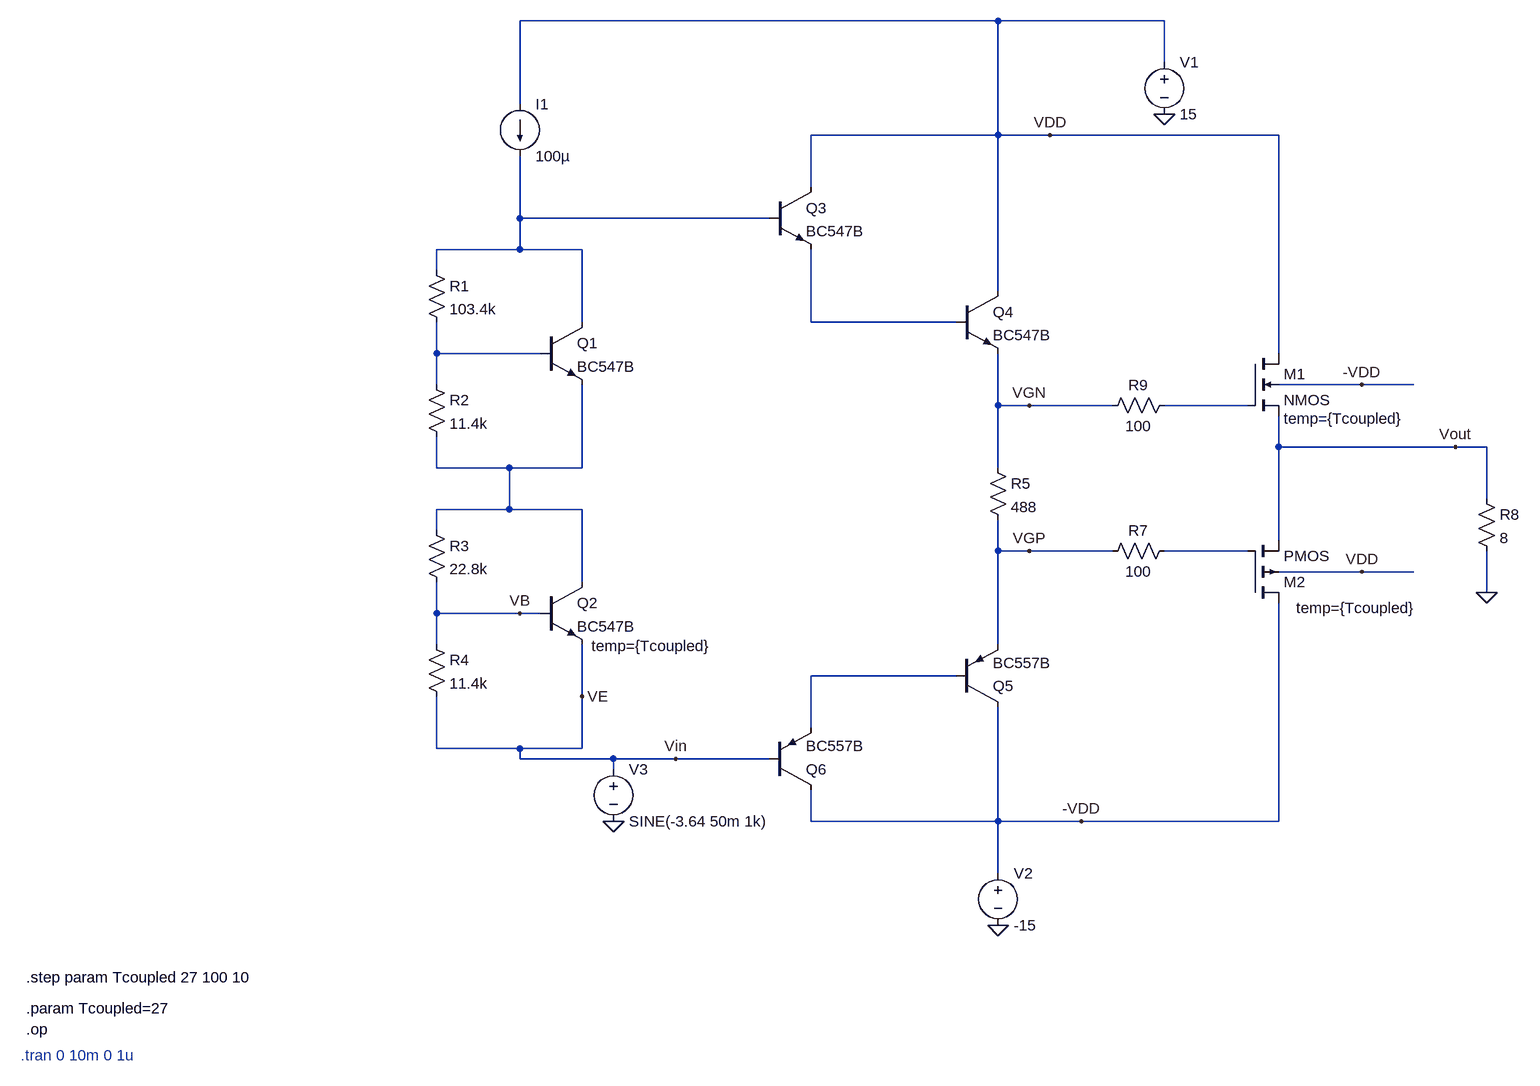
[diagram p0: schematic class_ab_power_amplifier.asc]
class_ab_power_amplifier.asc, the LTspice schematic file:
Version 4.1
SHEET 1 1844 2072
WIRE 864 -48 128 -48
WIRE 1120 -48 864 -48
WIRE 1120 16 1120 -48
WIRE 128 80 128 -48
WIRE 864 128 864 -48
WIRE 864 128 576 128
WIRE 944 128 864 128
WIRE 1296 128 944 128
WIRE 576 208 576 128
WIRE 128 256 128 160
WIRE 512 256 128 256
WIRE 128 304 128 256
WIRE 128 304 0 304
WIRE 224 304 128 304
WIRE 0 336 0 304
WIRE 864 368 864 128
WIRE 224 416 224 304
WIRE 576 416 576 304
WIRE 800 416 576 416
WIRE 0 464 0 416
WIRE 160 464 0 464
WIRE 1296 464 1296 128
WIRE 0 512 0 464
WIRE 1424 512 1296 512
WIRE 1504 512 1424 512
WIRE 864 544 864 464
WIRE 912 544 864 544
WIRE 1040 544 912 544
WIRE 1248 544 1120 544
WIRE 1296 608 1296 560
WIRE 1568 608 1296 608
WIRE 1616 608 1568 608
WIRE 0 640 0 592
WIRE 112 640 0 640
WIRE 224 640 224 512
WIRE 224 640 112 640
WIRE 864 640 864 544
WIRE 1616 688 1616 608
WIRE 112 704 112 640
WIRE 112 704 0 704
WIRE 224 704 112 704
WIRE 0 736 0 704
WIRE 1296 752 1296 608
WIRE 864 768 864 720
WIRE 912 768 864 768
WIRE 1040 768 912 768
WIRE 1248 768 1120 768
WIRE 1424 800 1296 800
WIRE 1504 800 1424 800
WIRE 224 816 224 704
WIRE 1616 832 1616 768
WIRE 0 864 0 816
WIRE 128 864 0 864
WIRE 160 864 128 864
WIRE 0 912 0 864
WIRE 864 912 864 768
WIRE 800 960 576 960
WIRE 224 992 224 912
WIRE 576 1040 576 960
WIRE 0 1072 0 992
WIRE 128 1072 0 1072
WIRE 224 1072 224 992
WIRE 224 1072 128 1072
WIRE 128 1088 128 1072
WIRE 272 1088 128 1088
WIRE 368 1088 272 1088
WIRE 512 1088 368 1088
WIRE 272 1104 272 1088
WIRE 576 1184 576 1136
WIRE 864 1184 864 1008
WIRE 864 1184 576 1184
WIRE 992 1184 864 1184
WIRE 1296 1184 1296 848
WIRE 1296 1184 992 1184
WIRE 864 1264 864 1184
FLAG 1120 96 0
FLAG 864 1344 0
FLAG 1616 832 0
FLAG 272 1184 0
FLAG 1424 512 -VDD
FLAG 1424 800 VDD
FLAG 992 1184 -VDD
FLAG 944 128 VDD
FLAG 128 864 VB
FLAG 224 992 VE
FLAG 1568 608 Vout
FLAG 368 1088 Vin
FLAG 912 544 VGN
FLAG 912 768 VGP
DATAFLAG 864 768 ""
DATAFLAG 128 256 ""
DATAFLAG 128 1072 ""
DATAFLAG 688 416 ""
DATAFLAG 640 960 ""
DATAFLAG 864 544 ""
DATAFLAG 0 464 ""
DATAFLAG 112 640 ""
DATAFLAG 0 864 ""
DATAFLAG 1296 608 ""
SYMBOL current 128 80 R0
WINDOW 123 0 0 Left 0
WINDOW 39 0 0 Left 0
SYMATTR InstName I1
SYMATTR Value 100µ
SYMBOL res -16 320 R0
SYMATTR InstName R1
SYMATTR Value 103.4k
SYMBOL res -16 496 R0
SYMATTR InstName R2
SYMATTR Value 11.4k
SYMBOL res -16 720 R0
SYMATTR InstName R3
SYMATTR Value 22.8k
SYMBOL res -16 896 R0
SYMATTR InstName R4
SYMATTR Value 11.4k
SYMBOL npn 160 416 R0
SYMATTR InstName Q1
SYMATTR Value BC547B
SYMBOL npn 160 816 R0
WINDOW 39 78 98 Left 2
SYMATTR InstName Q2
SYMATTR Value BC547B
SYMATTR SpiceLine temp={Tcoupled}
SYMBOL npn 512 208 R0
SYMATTR InstName Q3
SYMATTR Value BC547B
SYMBOL npn 800 368 R0
SYMATTR InstName Q4
SYMATTR Value BC547B
SYMBOL res 848 624 R0
SYMATTR InstName R5
SYMATTR Value 488
SYMBOL res 1136 528 R90
WINDOW 0 0 56 VBottom 2
WINDOW 3 32 56 VTop 2
SYMATTR InstName R9
SYMATTR Value 100
SYMBOL res 1136 752 R90
WINDOW 0 0 56 VBottom 2
WINDOW 3 32 56 VTop 2
SYMATTR InstName R7
SYMATTR Value 100
SYMBOL res 1600 672 R0
SYMATTR InstName R8
SYMATTR Value 8
SYMBOL voltage 1120 0 R0
WINDOW 123 0 0 Left 0
WINDOW 39 0 0 Left 0
SYMATTR InstName V1
SYMATTR Value 15
SYMBOL voltage 864 1248 R0
WINDOW 123 0 0 Left 0
WINDOW 39 0 0 Left 0
SYMATTR InstName V2
SYMATTR Value -15
SYMBOL voltage 272 1088 R0
WINDOW 123 0 0 Left 0
WINDOW 39 0 0 Left 0
SYMATTR InstName V3
SYMATTR Value SINE(-3.64 50m 1k)
SYMBOL pnp 800 1008 M180
SYMATTR InstName Q5
SYMATTR Value BC557B
SYMBOL pnp 512 1136 M180
SYMATTR InstName Q6
SYMATTR Value BC557B
SYMBOL nmos4 1248 464 R0
WINDOW 39 56 100 Left 2
SYMATTR InstName M1
SYMATTR Value2 l=1u w=20u m=9
SYMATTR SpiceLine temp={Tcoupled}
SYMBOL pmos4 1248 848 M180
WINDOW 39 75 -8 Left 2
SYMATTR InstName M2
SYMATTR Value2 l=1u w=20u m=9
SYMATTR SpiceLine temp={Tcoupled}
TEXT -640 1544 Left 2 ;.tran 0 10m 0 1u
TEXT -632 1504 Left 2 !.op
TEXT -632 1472 Left 2 !.param Tcoupled=27
TEXT -632 1424 Left 2 !.step param Tcoupled 27 100 10

The netlist it stands for:
* class_ab_power_amplifier.asc
I1 VDD N001 100µ
R1 N001 N003 103.4k
R2 N003 N005 11.4k
R3 N005 VB 22.8k
R4 VB Vin 11.4k
Q1 N001 N003 N005 0 BC547B
Q2 N005 VB Vin 0 BC547B temp={Tcoupled}
Q3 VDD N001 N002 0 BC547B
Q4 VDD N002 VGN 0 BC547B
R5 VGN VGP 488
R9 N004 VGN 100
R7 N006 VGP 100
R8 Vout 0 8
V1 VDD 0 15
V2 -VDD 0 -15
V3 Vin 0 SINE(-3.64 50m 1k)
Q5 -VDD N007 VGP 0 BC557B
Q6 -VDD Vin N007 0 BC557B
M1 VDD N004 Vout -VDD NMOS l=1u w=20u m=9 temp={Tcoupled}
M2 -VDD N006 Vout VDD PMOS l=1u w=20u m=9 temp={Tcoupled}
.model NPN NPN
.model PNP PNP
.lib standard.bjt
.model NMOS NMOS
.model PMOS PMOS
.lib standard.mos
* .tran 0 10m 0 1u
.op
.param Tcoupled=27
.step param Tcoupled 27 100 10
.backanno
.end